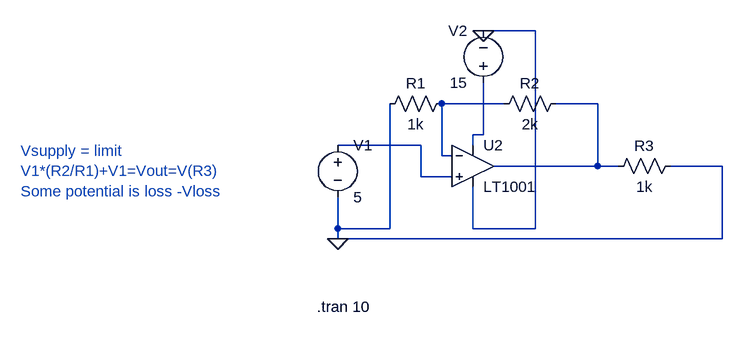
[diagram p0: schematic OpAmp Circuit.asc]
OpAmp Circuit.asc, the LTspice schematic file:
Version 4
SHEET 1 880 680
WIRE 320 -48 240 -48
WIRE 272 64 176 64
WIRE 416 64 352 64
WIRE 240 112 240 32
WIRE 240 112 224 112
WIRE 144 128 16 128
WIRE 224 128 224 112
WIRE 176 144 176 64
WIRE 192 144 176 144
WIRE 416 160 416 64
WIRE 416 160 256 160
WIRE 448 160 416 160
WIRE 608 160 528 160
WIRE 144 176 144 128
WIRE 192 176 144 176
WIRE 16 256 16 208
WIRE 96 256 96 64
WIRE 96 256 16 256
WIRE 224 256 224 192
WIRE 320 256 320 -48
WIRE 320 256 224 256
WIRE 16 272 16 256
WIRE 608 272 608 160
WIRE 608 272 16 272
FLAG 240 -48 0
FLAG 16 272 0
SYMBOL voltage 16 112 R0
WINDOW 123 0 0 Left 0
WINDOW 39 0 0 Left 0
SYMATTR InstName V1
SYMATTR Value 5
SYMBOL res 192 48 R90
WINDOW 0 0 56 VBottom 2
WINDOW 3 32 56 VTop 2
SYMATTR InstName R1
SYMATTR Value 1k
SYMBOL res 368 48 R90
WINDOW 0 0 56 VBottom 2
WINDOW 3 32 56 VTop 2
SYMATTR InstName R2
SYMATTR Value 2k
SYMBOL OpAmps\\LT1001 224 96 R0
SYMATTR InstName U2
SYMBOL voltage 240 48 R180
WINDOW 0 24 96 Left 2
WINDOW 3 24 16 Left 2
WINDOW 123 0 0 Left 0
WINDOW 39 0 0 Left 0
SYMATTR InstName V2
SYMATTR Value 15
SYMBOL res 544 144 R90
WINDOW 0 0 56 VBottom 2
WINDOW 3 32 56 VTop 2
SYMATTR InstName R3
SYMATTR Value 1k
TEXT -16 376 Left 2 !.tran 10
TEXT -472 136 Left 2 ;Vsupply = limit\nV1*(R2/R1)+V1=Vout=V(R3)\nSome potential is loss -Vloss

The netlist it stands for:
* OpAmp Circuit.asc
V1 N004 0 5
R1 N001 0 1k
R2 N002 N001 2k
XU2 N004 N001 N003 0 N002 LT1001  ; pins In+ In- V+ V- OUT
V2 N003 0 15
R3 0 N002 1k
.tran 10
* Vsupply = limit
* V1*(R2/R1)+V1=Vout=V(R3)
* Some potential is loss -Vloss
.lib LTC.lib
.backanno
.end